# Altium schematic sheet 12-DEBUG_JTAG.SchDoc
size A4
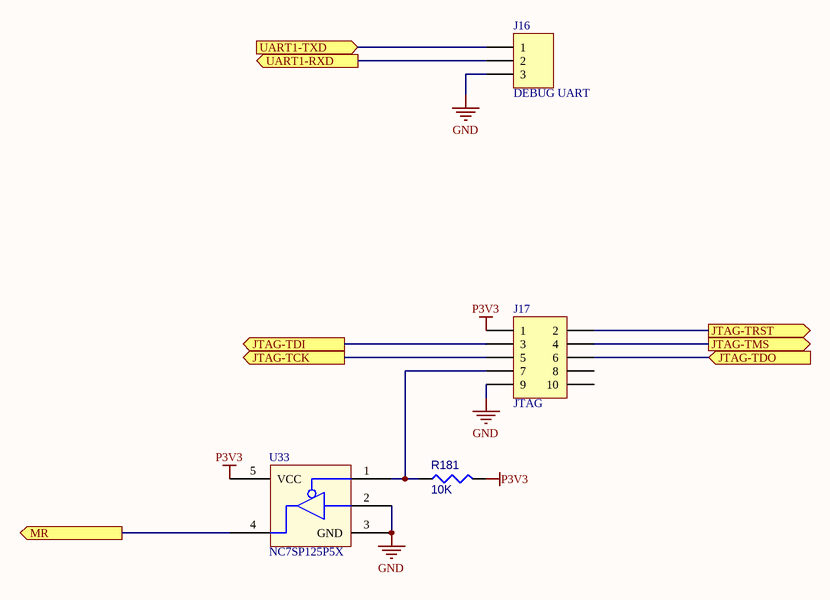
[diagram p0: 12-DEBUG_JTAG.SchDoc]

## Parts
J16  DEBUG UART  [HDR1X3]
J17  JTAG  [HDR2X5]
R181  10K  [0402]
U33  NC7SP125P5X  [SC70]

## Ports
JTAG-TCK (out), JTAG-TDI (out), JTAG-TDO (in), JTAG-TMS (out), JTAG-TRST (out), MR (out), UART1-RXD (out), UART1-TXD (in)

## Nets
GND: J16.3 J17.9 U33.2(A) U33.3(GND)
P3V3: J17.1 R181.1 U33.5(VCC)
JTAG-TCK: J17.5 ; port JTAG-TCK
JTAG-TDI: J17.3 ; port JTAG-TDI
JTAG-TDO: J17.6 ; port JTAG-TDO
JTAG-TMS: J17.4 ; port JTAG-TMS
JTAG-TRST: J17.2 ; port JTAG-TRST
MR: U33.4(Y) ; port MR
UART1-RXD: J16.2 ; port UART1-RXD
UART1-TXD: J16.1 ; port UART1-TXD
NetJ17_7: J17.7 R181.2 U33.1(OE)

Not connected (* = marked no-connect by the designer): J17 8 10

## Library data of the parts
J16 = Header 3: Header, 3-Pin; LatestRevisionDate: 17-Jul-2002; LatestRevisionNote: Re-released for DXP Platform.; Publisher: Altium Limited
J17 = Header 5X2: Header, 5-Pin, Dual row; LatestRevisionDate: 17-Jul-2002; LatestRevisionNote: Re-released for DXP Platform.; Publisher: Altium Limited
R181 = P_R